# EAGLE design 34063 (EAGLE 6.1)
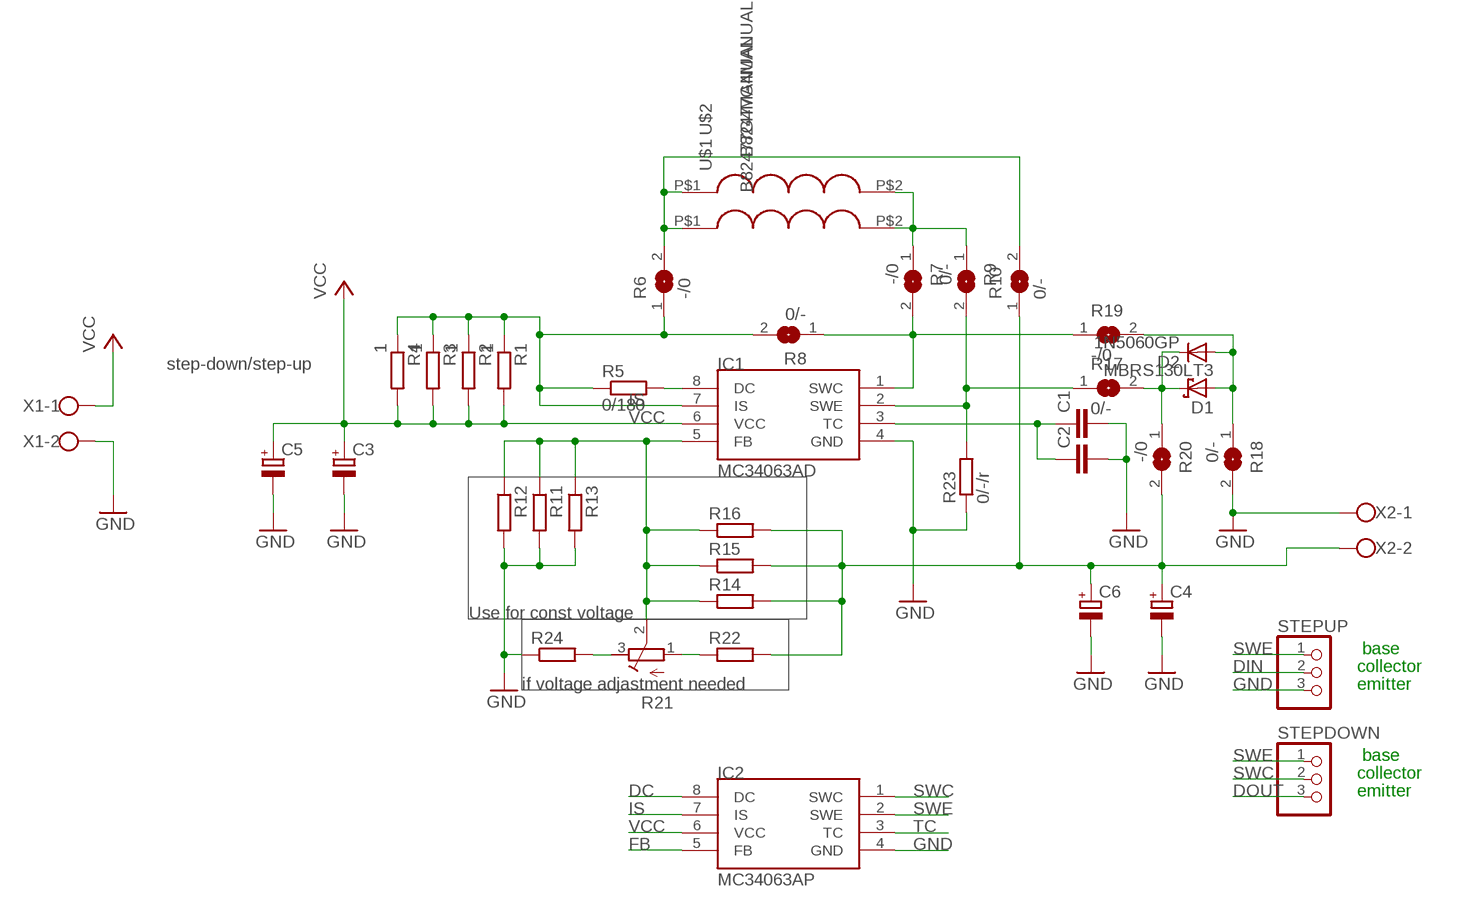
[diagram p0: schematic, sheet 1]

## Parts
C1  C-EUC0805  [C0805]
C2  C-EU050-024X044  [C050-024X044]
C3  CPOL-EUE5-13  [E5-13]
C4  CPOL-EUE5-13  [E5-13]
C5  CPOL-EUE2.5-7  [E2,5-7]
C6  CPOL-EUE2.5-7  [E2,5-7]
D1  MBRS130LT3  [SMB]
D2  1N5060GP  [DO15-12]
IC1  MC34063AD  [SOIC8]
IC2  MC34063AP  [DIL08]
R1  1  R-EU_M1206  [M1206]
R2  1  R-EU_M1206  [M1206]
R3  1  R-EU_M1206  [M1206]
R4  1  R-EU_M1206  [M1206]
R5  0/180  R-EU_M0805  [M0805]
R6  -/0  SJ  [SJ]
R7  -/0  SJ  [SJ]
R8  0/-  SJ  [SJ]
R9  0/-  SJ  [SJ]
R10  0/-  SJ  [SJ]
R11  R-EU_R0805  [R0805]
R12  R-EU_R0805  [R0805]
R13  R-EU_0204/2V  [0204V]
R14  R-EU_R0805  [R0805]
R15  R-EU_R0805  [R0805]
R16  R-EU_0204/2V  [0204V]
R17  0/-  SJ  [SJ]
R18  0/-  SJ  [SJ]
R19  -/0  SJ  [SJ]
R20  -/0  SJ  [SJ]
R21  R-TRIMM64W  [RTRIM64W]
R22  R-EU_R0805  [R0805]
R23  0/-/r  R-EU_R0805  [R0805]
R24  R-EU_R0805  [R0805]
STEPDOWN  PINHD-1X3  [1X03]
STEPUP  PINHD-1X3  [1X03]
U$1  B82477G4MANUAL  [B82477G4_MANUAL]
U$2  B82477G4MANUAL  [B82477G4_MANUAL]
X1  W237-102  [W237-102]
X2  W237-102  [W237-102]

## Nets
DC: IC1.8(DC) IC2.8(DC) R5.2
DIN: D1.A D2.A R18.1 R19.2 STEPUP.2
DOUT: D1.C D2.C R17.2 R20.1 STEPDOWN.3
FB: IC1.5(FB) IC2.5(FB) R11.1 R12.1 R13.1 R14.1 R15.1 R16.1 R21.2(S)
GND: C1.2 C2.2 C3.- C4.- C5.- C6.- IC1.4(GND) IC2.4(GND) R11.2 R12.2 R13.2 R18.2 R23.1 R24.1 STEPUP.3 X1.2 X2.1
IS: IC1.7(IS) IC2.7(IS) R1.1 R2.1 R3.1 R4.1 R5.1 R6.1 R8.2
L1: R7.1 R9.1 U$1.P$2 U$2.P$2
L2: R6.2 R10.2 U$1.P$1 U$2.P$1
N$1: R21.3(E) R24.2
N$2: R21.1(A) R22.1
SWC: IC1.1(SWC) IC2.1(SWC) R7.2 R8.1 R19.1 STEPDOWN.2
SWE: IC1.2(SWE) IC2.2(SWE) R9.2 R17.1 R23.2 STEPDOWN.1 STEPUP.1
TC: C1.1 C2.1 IC1.3(TC) IC2.3(TC)
VCC: C3.+ C5.+ IC1.6(VCC) IC2.6(VCC) R1.2 R2.2 R3.2 R4.2 X1.1
VOUT: C4.+ C6.+ R10.1 R14.2 R15.2 R16.2 R20.2 R22.2 X2.2

## Notes on the sheet
- step-down/step-up
- Use for const voltage
- base
- collector
- if voltage adjastment needed | emitter
- base
- collector
- emitter

## Library data of the parts
C1 C2 = rcl:C-EU: CAPACITOR, European symbol
C3-C6 = rcl:CPOL-EU: POLARIZED CAPACITOR, European symbol
D1 = diode:MBRS130LT3: Schottky Power Rectifier Source: http://www.onsemi.com/pub/Collateral/MBRS130LT3-D.PDF
D2 = diode:1N5060GP: DIODE controlled avalanche rectifier
IC1 IC2 = mc34063:MC34063
R1-R5 R11-R16 R22-R24 = rcl:R-EU_: RESISTOR, European symbol
R6-R10 R17-R20 = jumper:SJ: SMD solder JUMPER
R21 = rcl:R-TRIMM: Trimm resistor
STEPDOWN STEPUP = pinhead:PINHD-1X3: PIN HEADER
U$1 U$2 = epcos_SMT_power_inductor:B82477G4: EPCOS SMT power inductors Size 12.8 u 12.8 u 8.0 (mm) Series/Type: B82477G4 Rated inductance 1 ... 1000 ?H Rated current 0.55 ... 9.8 A
X1 X2 = con-wago-500:W237-102: WAGO SCREW CLAMP; MPN: 237-102; OC_FARNELL: unknown; OC_NEWARK: 70K9898

## Board
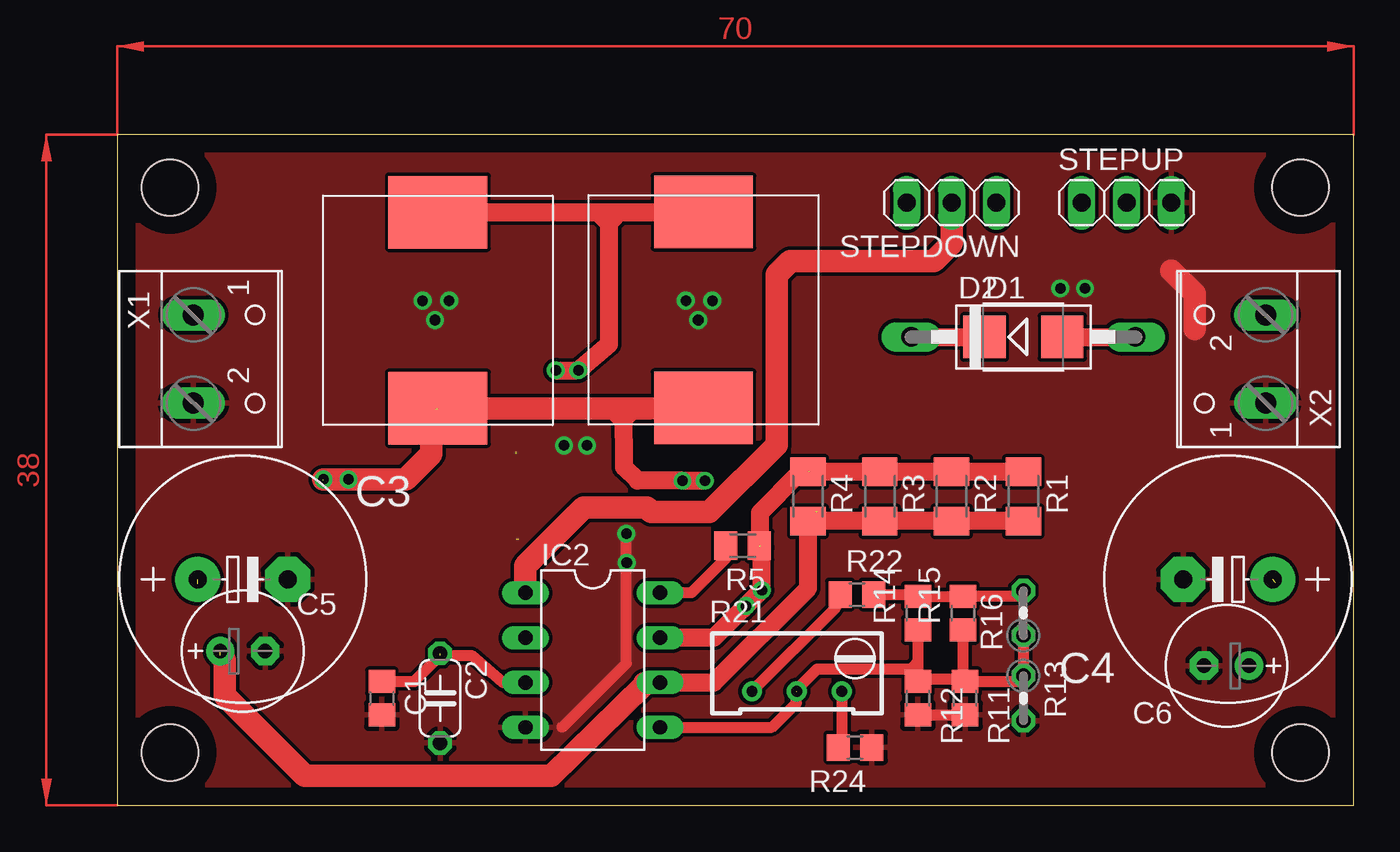
[diagram p1: board, top side]
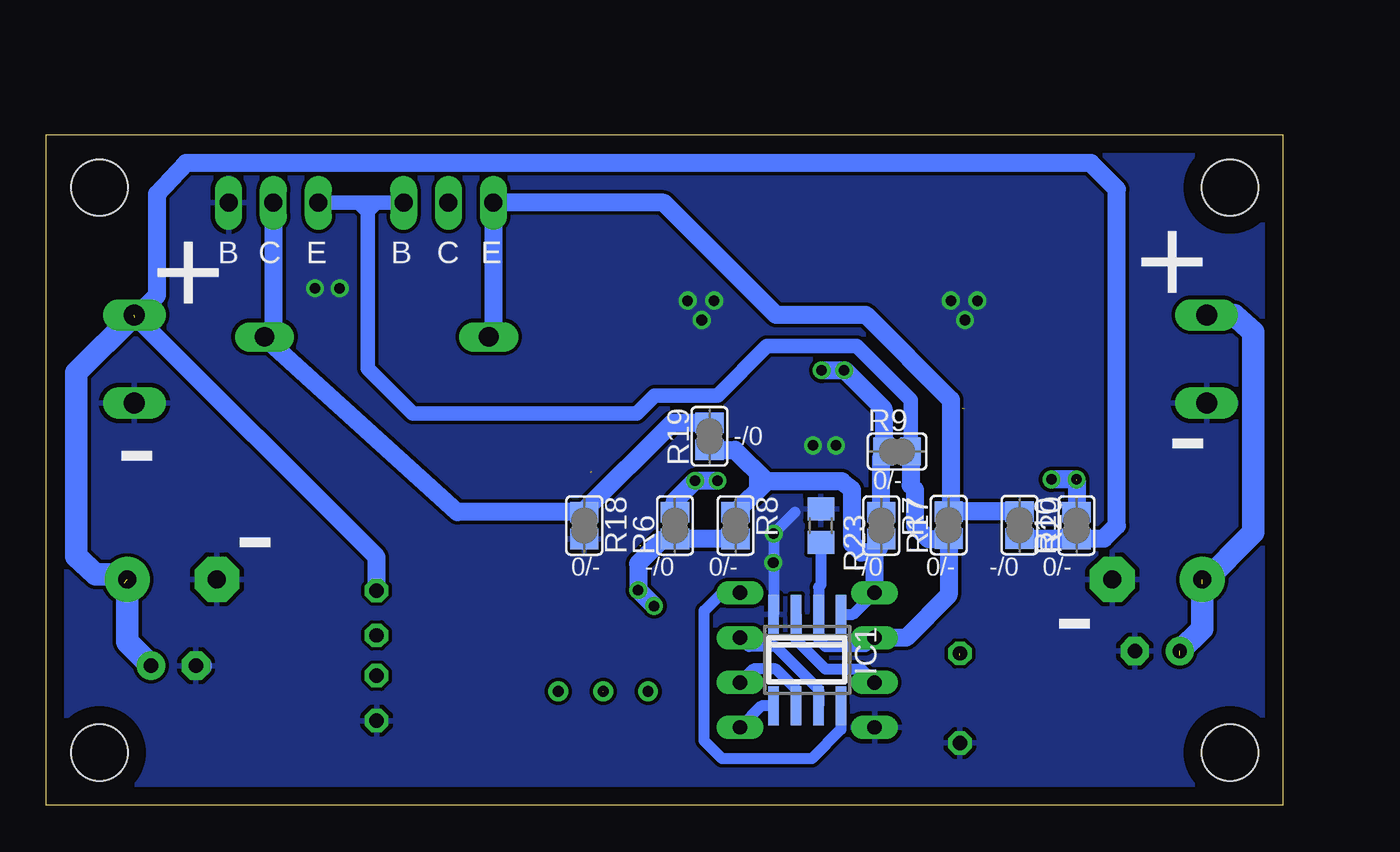
[diagram p2: board, bottom side, seen from below]

Size 70 x 38 mm. Coordinates in mm from the lower left corner, seen from the top.
Outline: 0,0 70,0 70,38 0,38 0,0
Copper layers (1*16): Top 0.035mm / dielectric 1.5mm / Bottom 0.035mm
Design rules: minimum track width 6mil, minimum drill 0.3mm, track to track 0.205mm, track to pad 0.205mm, pad to pad 0.205mm, via to via 0.205mm, smd to smd 8mil, copper to edge 40mil, drill to drill 8mil, minimum pad ring 10mil, minimum via ring 8mil, stop-mask expansion 4mil, vias tented up to drill 0.6mm, thermal gap 10mil
Holes 3.2 mm at 3,35 3,3 67,3 67,35

### Footprints (pad centres in the part's own frame; a part is rotated, then mirrored left to right if it is on the bottom)
C0805 = smd 1.3 x 1.5: 1 -0.95,0; 2 0.95,0
C050-024X044 = drill 0.813 octagon: 1 -2.54,0; 2 2.54,0
E5-13 = drill 1.016 pad 2.54: + -2.54,0 | drill 1.016 pad 2.54 octagon: - 2.54,0
E2,5-7 = drill 0.813 pad 1.6: + -1.27,0 | drill 0.813 pad 1.6 octagon: - 1.27,0
SMB = smd 2.4 x 2.4: A 2.2,0; C -2.2,0
DO15-12 = drill 1.118 long: A 6.35,0; C -6.35,0
SOIC8 = smd 0.6 x 2.2: 1 -1.905,-2.6; 2 -0.635,-2.6; 3 0.635,-2.6; 4 1.905,-2.6; 5 1.905,2.6; 6 0.635,2.6; 7 -0.635,2.6; 8 -1.905,2.6
DIL08 = drill 0.813 long: 1 -3.81,-3.81; 2 -1.27,-3.81; 3 1.27,-3.81; 4 3.81,-3.81; 5 3.81,3.81; 6 1.27,3.81; 7 -1.27,3.81; 8 -3.81,3.81
M1206 = smd 1.6 x 2: 1 -1.4,0; 2 1.4,0
M0805 = smd 1.3 x 1.6: 1 -0.95,0; 2 0.95,0
SJ = smd 1.168 x 1.6: 1 -0.762,0; 2 0.762,0
R0805 = smd 1.3 x 1.5: 1 -0.95,0; 2 0.95,0
0204V = drill 0.813 octagon: 1 -1.27,0; 2 1.27,0
RTRIM64W = drill 0.61: 1 1.27,-2.54; 2 1.27,0; 3 1.27,2.54
1X03 = drill 1.016 long: 1 -2.54,0; 2 0,0; 3 2.54,0
B82477G4_MANUAL = smd 4.1 x 5.6: P$1 5.55,0; P$2 -5.55,0
W237-102 = drill 1.194 long: 1 -2.5,-1.27; 2 2.5,-1.27

### Placement (x,y rotation side)
C1  14.99,6.08 270 top
C2  18.29,6.08 270 top
C3  7.11,12.81 0 top
C4  62.89,12.81 180 top
C5  7.11,8.75 0 top
C6  62.8,7.92 180 top
D1  51.31,26.54 0 top
D2  51.31,26.54 0 top
IC1  26.92,8.24 180 bottom
IC2  26.92,8.24 270 top
R1  51.31,17.51 270 top
R2  47.24,17.51 270 top
R3  43.18,17.51 270 top
R4  39.12,17.51 270 top
R5  35.42,14.72 180 top
R6  34.42,15.86 90 bottom
R7  22.73,15.86 270 bottom
R8  30.99,15.86 270 bottom
R9  21.84,20.05 0 bottom
R10  11.68,15.86 90 bottom
R11  48.01,6.08 270 top
R12  45.34,6.08 270 top
R13  51.31,6.08 270 top
R14  45.34,10.91 90 top
R15  47.88,10.91 90 top
R16  51.31,10.91 90 top
R17  18.92,15.89 90 bottom
R18  39.55,15.86 270 bottom
R19  32.46,20.91 90 bottom
R20  14.91,15.89 270 bottom
R21  38.48,7.73 270 top
R22  41.88,11.95 0 top
R23  26.16,15.86 270 bottom
R24  41.78,3.29 180 top
STEPDOWN  47.24,34.15 180 top
STEPUP  57.15,34.15 0 top
U$1  33.2,28.08 270 top
U$2  18.16,28.05 270 top
X1  5.59,25.29 270 top
X2  63.75,25.29 90 top

### Tracks (layer width: path | path; a pad name or v marks a point on that pad's centre or on a via)
DC
  Top 0.61: IC2.8 32.51,12.05 34.47,14.01 R5.2
  Bottom 0.61: IC2.8 31.75,12.05 32.77,11.03 32.77,3.67 31.75,2.65 26.67,2.65 25.02,4.3 IC1.8
DIN  (1 unrouted)
  Top 1.016: D1.A D2.A
  Bottom 1.016: R19.2 34.57,21.68 39.62,16.62 46.74,16.62 D2.A 57.15,27.05 STEPUP.2
DOUT
  Top 1.016: D2.C D1.C
  Bottom 1.016: R20.1 R17.2 | R17.2 19.02,16.65 19.05,16.62 | R17.2 18.8,16.77 18.8,22.97 23.62,27.8 28.7,27.8 35.05,34.15 STEPDOWN.3 44.7,26.8 D2.C
FB  (1 unrouted)
  Top 0.61: R14.1 45.34,7.73 | 45.34,7.73 R12.1 | R12.1 45.34,6.84 45.47,6.72 45.47,6.9 R12.1 | R15.1 47.88,7.16 | 47.88,7.16 R11.1 50.99,7.03 R13.1 R16.1 | 47.88,7.16 45.47,7.16 R12.1 | IC2.5 37.08,4.43 38.46,5.8 38.46,6.41 38.48,6.44 38.48,6.59 39.62,7.73 45.34,7.73
  Bottom 0.61: IC1.5 29.52,5.64 IC2.5
GND  (via drill 0.6)
  Top 0.61: 45.21,5 R12.2 R11.2 | 25.2,4.43 28.83,8.06 v28.83,15.4
  Top 1.27: 59.69,30.31 61,29 61,27
  Bottom 0.61: v28.83,15.4 IC1.4 | v28.83,15.4 28.83,13.78 v28.85,13.75 | 27.61,16.62 v28.83,15.4
  Bottom 1.27: C6.- 61.26,7.92 | 60.33,12.79 C4.-
  other vias: 17.3,28.6 18.8,28.6 18,27.5 32.2,28.6 33.7,28.6 32.9,27.5 25.3,20.4 26.6,20.4 53.4,29.3 54.8,29.3
  pour Bottom: 0,38 0,0 70,0 70,38
  pour Top: 0,38 0,0 70,0 70,38
IS  (via drill 0.6)  (2 unrouted)
  Top 1.016: IC2.7 33.78,9.51 35.37,11.1 35.4,11.1 v35.6,11.3 v36.5,12.2 36.5,14.6 36.4,14.7 36.4,16.6 38.6,18.8 39.1,18.8 39.2,18.9 | R4.1 R3.1 R2.1 R1.1
  Bottom 0.61: IC2.7 30.23,9 28.7,9 26.29,6.59 IC1.7
  Bottom 1.016: R8.2 R6.1 35.1,15.1 36.5,13.7 v36.5,12.2 v35.6,11.3
L1  (via drill 0.6)  (1 unrouted)
  Top 1.016: U$2.P$2 27.84,33.6 | 27.84,33.6 U$1.P$2 | v24.84,24.65 26.04,24.65 | 27.84,33.6 27.84,26.12 v26.11,24.65
  Bottom 1.016: R7.1 22.73,19.8 22.61,19.92 | v26.11,24.65 v24.84,24.65 24.79,24.65 22.61,22.46 R9.1
L2  (via drill 0.6)  (2 unrouted)
  Top 1.016: v33.27,18.4 v32,18.4 29.46,18.4 28.7,19.16 28.69,22.46 U$1.P$1
  Top 1.27: U$2.P$1 30.12,22.5 U$1.P$1 | v11.68,18.48 16.33,18.48 17.78,19.92 17.78,22.21 18.03,22.46
  Bottom 1.016: v11.68,18.48 v13.11,18.48 | 11.68,18.4 R10.2 | v32,18.4 v33.27,18.4 34.42,17.26 R6.2
N$1
  Top 0.61: R21.3 41.02,3.48 R24.2
N$2
  Top 0.61: R22.1 40.68,11.2 R21.1
N$3
  Bottom 0.305: 30.07,17.88 30.07,18.9
N$4
  Top 0.305: 45.31,8.33 44.91,7.92
N$5
  Top 0.305: 28.65,21.54 28.45,21.54 27.84,22.15 29.46,22.15 | 29.67,22.15 29.46,22.15 | 29.46,22.15 29.06,21.74
N$6
  Top 0.305: 27.64,32.92 27.43,32.92 27.03,33.33 28.65,33.33 28.25,32.92
SWC  (1 unrouted)
  Top 1.27: STEPDOWN.2 47.24,31.86 46.23,30.85 38.1,30.85 37.34,30.08 37.34,20.43 33.53,16.62 30.23,16.62 29.97,16.88 26.42,16.88 23.11,13.57 IC2.1
  Bottom 0.61: IC1.1 24.32,10.84 IC2.1
  Bottom 1.016: IC2.1 23.11,14.34 | 23.11,14.34 22.86,14.59 22.86,14.84 22.61,15.1 | 23.11,14.34 23.88,14.34 24.38,14.84 24.38,17.89 24.97,18.37 29.23,18.37 | 29.23,18.37 R8.1 | R19.1 31.02,20.15 29.23,18.37
SWE
  Bottom 0.305: 51.82,33.33 51,34.14
  Bottom 0.61: IC2.2 23.62,9 25.91,9 26.29,9.38 IC1.2 26.29,12.38 26.16,12.51 R23.2
  Bottom 0.813: R9.2 21.08,22.97 24.13,26.02 29.21,26.02 32,23.23 35.56,23.23 36.58,22.21 49.28,22.21 51.82,24.75 51.82,33.33 51.82,33.64 52.32,34.15 STEPUP.1 STEPDOWN.1
  Bottom 1.016: R9.2 21.08,18.15 20.83,17.89 20.83,15.86 20.07,15.1 18.95,15.1 R17.1 18.92,11.92 21.34,9.51 IC2.2
TC  (1 unrouted)
  Top 0.61: C1.1 16.82,7.03 18.29,8.49 20.07,8.49 21.84,6.97 IC2.3
  Bottom 0.61: IC1.3 27.56,9.38 25.91,7.73 23.88,7.73 IC2.3
VCC  (2 unrouted)
  Top 1.016: R1.2 R2.2 R3.2 R4.2 39.12,12.3 33.78,6.97 IC2.6 30.68,6.92 29.84,6.92
  Top 1.27: 29.84,6.92 29.84,6.84 24.58,1.67 10.63,1.67 6.1,6.21 6.1,8.24 5.84,8.49
  Bottom 0.61: IC1.6 27.56,6.59 28.7,7.73 29.97,7.73 IC2.6
  Bottom 1.27: X1.1 2.75,27.79 1.67,26.81 1.67,15.46 4.57,12.56 4.57,10.02 C5.+
VOUT  (2 unrouted)
  Top 0.61: R14.2 R15.2 50.99,11.85 R16.2 | 45.38,11.89 R14.2 | R22.2 44.74,11.95 R14.2
  Bottom 1.016: R10.1 14.88,15.1 R20.2 10.13,15.12 9.4,15.86 9.4,34.91 10.88,36.39 62.1,36.39 63.75,34.64 63.75,28.9 65.01,27.64 | R16.2 51.31,14.07 X2.2
  Bottom 1.27: C4.+ 65.43,9.27 C6.+ | X2.2 68.3,24.51 68.3,14.1 67.2,13.1 66.1,13.1 65.6,12.6
(copper drawn outside any net)
  shapes: Top area x2

### Text on the board
tSilkscreen: STEP-DOWN | STEP-UP | in | E | C | B | E | C | B | + | < | < | < | R5 | out | R22 | R14 | R16 | R21 | C1 | R12 | R11 | R24 | adj | T_N | 34063
bSilkscreen: E | C | B | E | C | B | + | + | -/0 | - | 0/- | - | 0/- | -/0 | 0/- | -/0 | 0/- | -/0 | 0/- | - | -